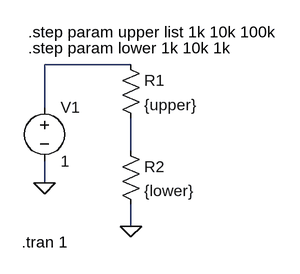
[diagram p0: schematic L3 C.asc]
L3 C.asc, the LTspice schematic file:
Version 4
SHEET 1 880 680
WIRE 288 64 160 64
WIRE 160 128 160 64
WIRE 288 192 288 144
WIRE 160 240 160 208
WIRE 288 304 288 272
FLAG 160 240 0
FLAG 288 304 0
SYMBOL res 272 48 R0
SYMATTR InstName R1
SYMATTR Value {upper}
SYMBOL res 272 176 R0
SYMATTR InstName R2
SYMATTR Value {lower}
SYMBOL voltage 160 112 R0
WINDOW 123 0 0 Left 0
WINDOW 39 0 0 Left 0
SYMATTR InstName V1
SYMATTR Value 1
TEXT 136 16 Left 2 !.step param upper list 1k 10k 100k
TEXT 136 40 Left 2 !.step param lower 1k 10k 1k
TEXT 126 328 Left 2 !.tran 1

The netlist it stands for:
* L3 C.asc
R1 N001 N002 {upper}
R2 N002 0 {lower}
V1 N001 0 1
.step param upper list 1k 10k 100k
.step param lower 1k 10k 1k
.tran 1
.backanno
.end